# Altium schematic sheet WatchDog.SchDoc
size A; SheetNumber: 14; SheetTotal: 15
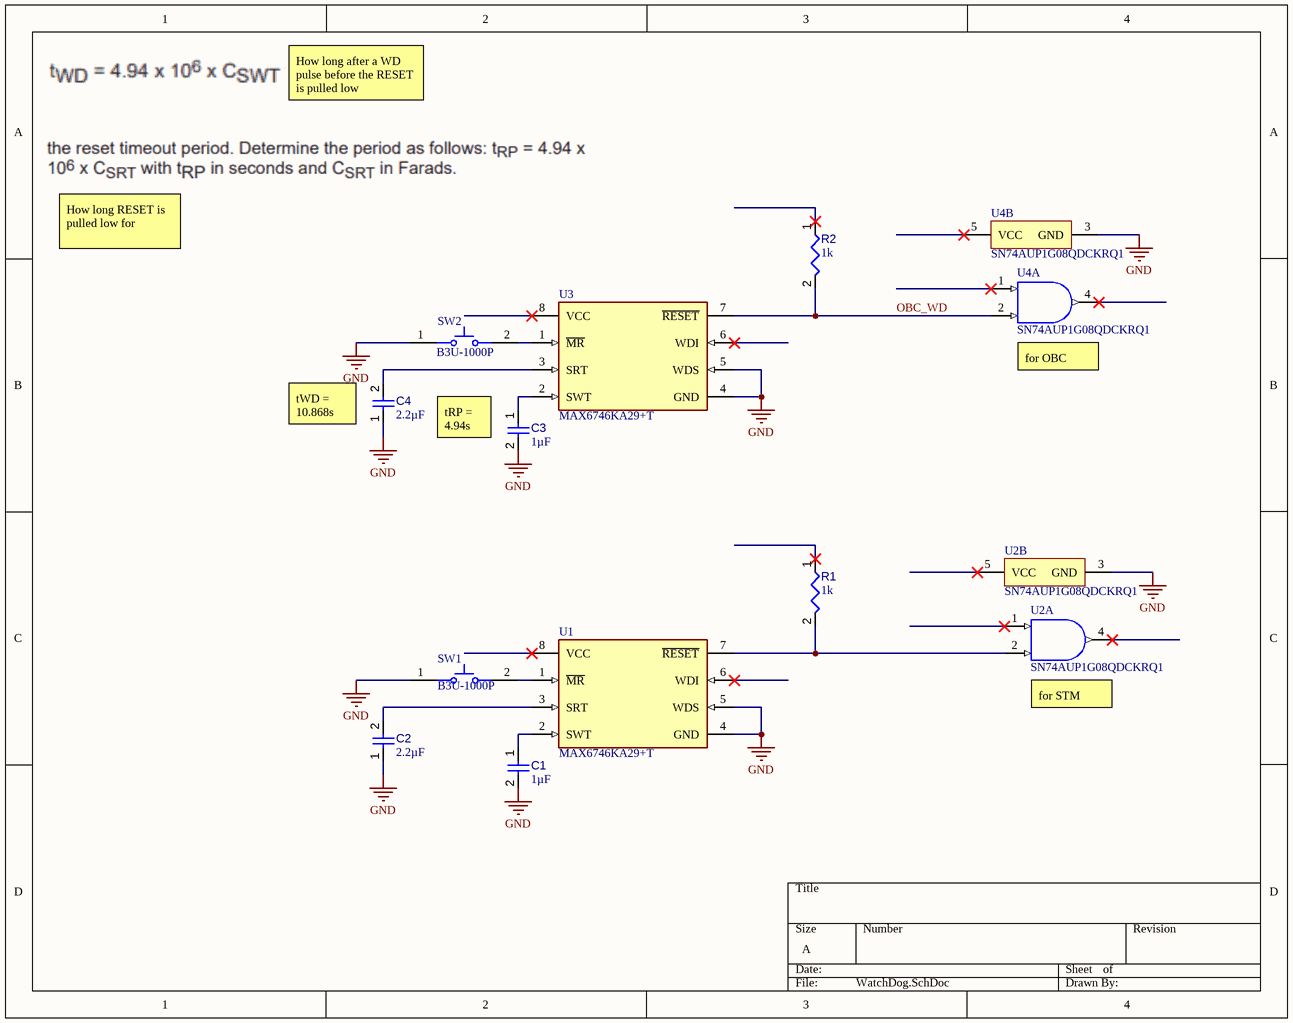
[diagram p0: WatchDog.SchDoc]

## Parts
C1  value 1µF  [CAPC0603(1608)100_L]  (hidden comment: Capacitor 1µF +/-40% 50V 0603)
C2  value 2.2µF  [CAPC0402(1005)60_L]  (hidden comment: Capacitor 2,2µF +/-20% 10V 0402)
C3  value 1µF  [CAPC0603(1608)100_L]  (hidden comment: Capacitor 1µF +/-40% 50V 0603)
C4  value 2.2µF  [CAPC0402(1005)60_L]  (hidden comment: Capacitor 2,2µF +/-20% 10V 0402)
R1  value 1k  [RESC0805(2012)_L]  (hidden comment: 1KR5J)
R2  value 1k  [RESC0805(2012)_L]  (hidden comment: 1KR5J)
SW1  B3U-1000P  [OMRON-B3U-1000_V]
SW2  B3U-1000P  [OMRON-B3U-1000_V]
U1  MAX6746KA29+T  [FP-K8-5-IPC_C]
U2  SN74AUP1G08QDCKRQ1  [DCK0005A_N]  (parts A,B of 2)
U3  MAX6746KA29+T  [FP-K8-5-IPC_C]
U4  SN74AUP1G08QDCKRQ1  [DCK0005A_N]  (parts A,B of 2)

## Nets
GND: C1.2 C2.1 C3.2 C4.1 SW1.1 SW2.1 U1.4(GND) U1.5(WDS) U2.3(GND) U3.4(GND) U3.5(WDS) U4.3(GND)
OBC_WD: R2.2 U3.7(~{RESET}) U4.2(B)
NetC1_1: C1.1 U1.2(SWT)
NetC2_2: C2.2 U1.3(SRT)
NetC3_1: C3.1 U3.2(SWT)
NetC4_2: C4.2 U3.3(SRT)
NetR1_2: R1.2 U1.7(~{RESET}) U2.2(B)
NetSW1_2: SW1.2 U1.1(~{MR})
NetSW2_2: SW2.2 U3.1(~{MR})

Not connected (* = marked no-connect by the designer): R1 1*; R2 1*; U1 6(WDI)* 8(VCC)*; U2 1(A)* 4(Y)* 5(VCC)*; U3 6(WDI)* 8(VCC)*; U4 1(A)* 4(Y)* 5(VCC)*

## Notes on the sheet
- How long after a WD pulse before the RESET is pulled low
- How long RESET is pulled low for
- (near U4) for OBC
- (near C4) tWD = 10.868s
- (near C3) tRP = 4.94s
- (near U2) for STM

## Library data of the parts
C1 C3 = CMP-001-00078-4: Chip Capacitor, 1µF +/-40%, 50V, 0603, Thickness 1 mm; Tolerance: 10%; Case/Package: 0603; Pins: 2; Max Operating Temperature: 85°C; Voltage Rating: 50V; Mounting Technology: SMT; Min Operating Temperature: -55°C
C2 C4 = CMP-001-00056-4: Chip Capacitor, 2,2µF +/-20%, 10V, 0402, Thickness 0.6 mm; Tolerance: 10%; Mounting Technology: SMT; Max Operating Temperature: 85°C; Case/Package: 0402; Pins: 2; Min Operating Temperature: -55°C; Voltage Rating: 10V
R1 R2 = CMP-009-00076-2: 1K 0.125W 5% 0805 (2012 Metric)  SMD; Power: 125mW; Pins: 2; Mounting Technology: SMT; Tolerance: 5%; Case/Package: 0805
SW1 SW2 = CMP-011-00000-2: Tactile Switch, SPST-NO, 0.05 A, 12 V, -25 to 70 degC, 2-Pin SMD, RoHS, Tape and Reel; Manufacturer: Omron Electronic Components; IP Rating: IP40; Current Rating: 50mA; Max Contact Resistance: 100mohm; Operating Force: 153gf; Throw Configuration: SPST; Resistance: 0.1Ohm; Max Voltage Rating (DC): 12V; Contact Material: Silver; Max Current Rating: 50mA; Datasheet URL: http://www.omron.com/ecb/products/pdf/en-b3u.pdf; Mounting Technology: SM; Case/Package: B3U-1000; Packaging: TapeandReel; Package Reference: B3U-1000; Manufacturer URL: http://www.omron.com/; Datasheet Version: Jan-15; RoHS Compliant: True; Max Operating Temperature: 70°C; Contact Current Rating: 50mA; Package Quantity: 3500; Package Description: 2-Pin Surface Mount Device, Body 3 x 2.5 mm; Voltage Rating (DC): 12V; Min Operating Temperature: -25°C; Voltage Rating: 12V
U1 U3 = CMP-00023-00003-1: Power Supply Management Circuit, Adjustable, 1 Channel, BICMOS, PDSO8; Pins: 8; RoHS Compliant: Yes; Max Operating Temperature: 125°C; Case/Package: LSSOP; Min Operating Temperature: -40°C
U2 U4 = CMP-016-00011-1: AND Gate, AUP/ULP/V Series, 1-Func, 2-Input, CMOS, PDSO5; Max Supply Voltage: 3.6V; Min Supply Voltage: 800mV; Nominal Supply Voltage: 3.3V; Case/Package: TSSOP; Max Operating Temperature: 125°C; RoHS Compliant: Yes; Pins: 5; Logic Type: AND GATE; Min Operating Temperature: -40°C